# Altium schematic sheet ESenseFE-AnalogFilters.SchDoc
size C
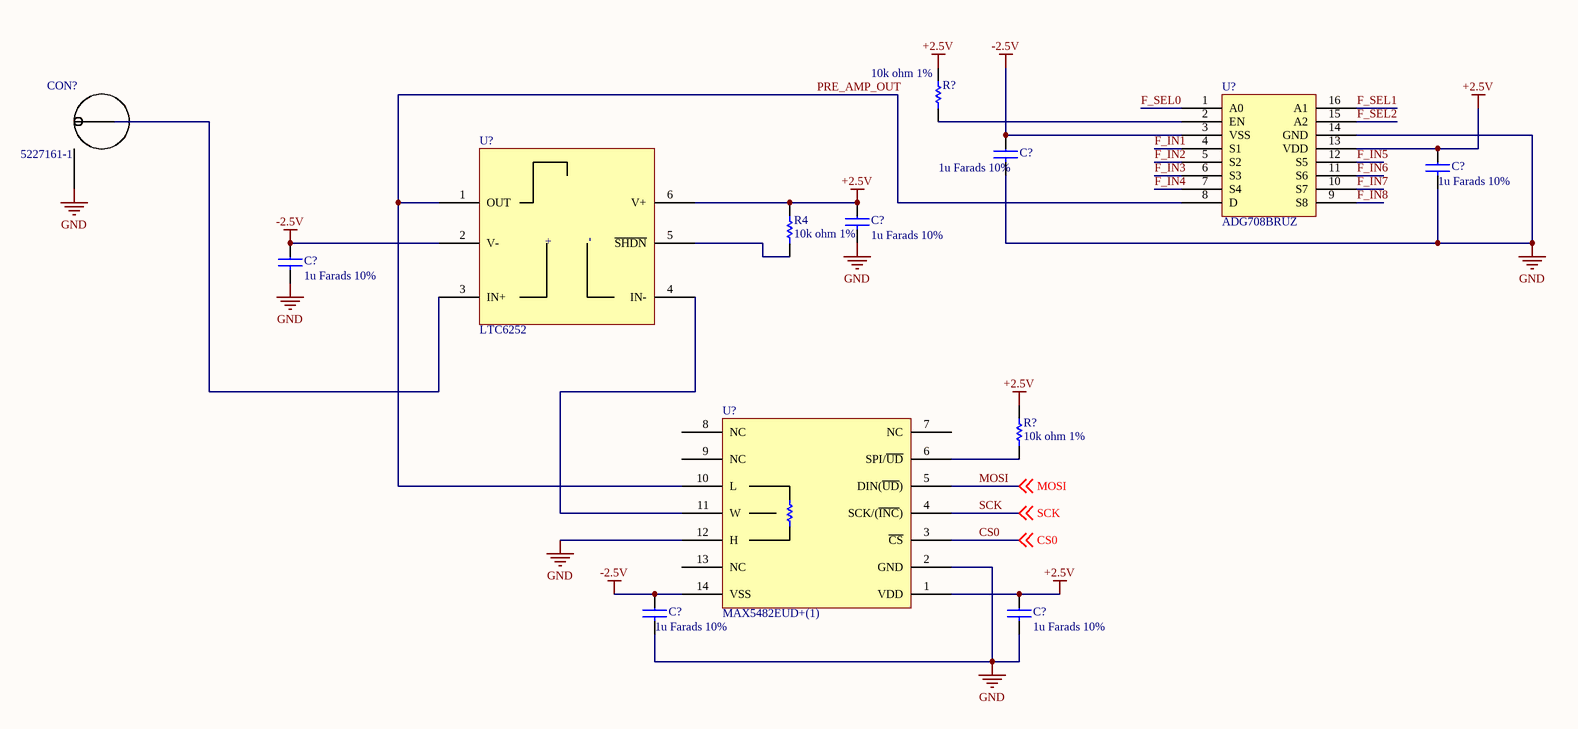
[diagram p0: ESenseFE-AnalogFilters.SchDoc]

## Parts
(Parts that share a designator on the sheet are numbered #1, #2 ... from top to bottom, then left to right.)
C?#1  1u Farads 10%  [SM/C_0603]
C?#2  1u Farads 10%  [SM/C_0603]
C?#3  1u Farads 10%  [SM/C_0603]
C?#4  1u Farads 10%  [SM/C_0603]
C?#5  1u Farads 10%  [SM/C_0603]
C?#6  1u Farads 10%  [SM/C_0603]
CON?  5227161-1  [BNC-RightAngle-PCB-50Ohm-Termination]
R4  10k ohm 1%  [SM/C_0603]
R?#1  10k ohm 1%  [SM/C_0603]
R?#2  10k ohm 1%  [SM/C_0603]
U?#1  ADG708BRUZ  [TSSOP-AD708-AnalogMux]
U?#2  LTC6252  [TSOT-23-LTC6252-OpAmp]
U?#3  MAX5482EUD+(1)  [TSSOP-16Lead-MAX548X]

## Nets
+2.5V: C?#2.1 C?#3.1 C?#6.1 R4.2 R?#1.2 R?#2.2 U?#1.13(VDD) U?#2.6(V+) U?#3.1(VDD)
-2.5V: C?#1.1 C?#4.1 C?#5.1 U?#1.3(VSS) U?#2.2(V-) U?#3.14(VSS)
GND: C?#1.2 C?#2.2 C?#3.2 C?#4.2 C?#5.2 C?#6.2 CON?.2 U?#1.14(GND) U?#3.2(GND) U?#3.12(H)
CS0: U?#3.3(~{CS}) ; off-sheet CS0
F_IN1: U?#1.4(S1)
F_IN2: U?#1.5(S2)
F_IN3: U?#1.6(S3)
F_IN4: U?#1.7(S4)
F_IN5: U?#1.12(S5)
F_IN6: U?#1.11(S6)
F_IN7: U?#1.10(S7)
F_IN8: U?#1.9(S8)
F_SEL0: U?#1.1(A0)
F_SEL1: U?#1.16(A1)
F_SEL2: U?#1.15(A2)
MOSI: U?#3.5(DIN(~{UD})) ; off-sheet MOSI
PRE_AMP_OUT: U?#1.8(D) U?#2.1(OUT) U?#3.10(L)
SCK: U?#3.4(SCK/(~{INC})) ; off-sheet SCK
NetCON?_1: CON?.1 U?#2.3(IN+)
NetR4_1: R4.1 U?#2.5(~{SHDN})
NetR?#1_1: R?#1.1 U?#1.2(EN)
NetR?#2_1: R?#2.1 U?#3.6(SPI/~{UD})
NetU?#2_4: U?#2.4(IN-) U?#3.11(W)

Not connected (* = marked no-connect by the designer): U?#3 7(NC) 8(NC) 9(NC) 13(NC)

## Notes on the sheet
- (in symbol 2192) +; -

## Library data of the parts
C?#1-C?#6 = 2065: CAP CER 1.0UF 10V 10% X5R 0603; mfrName: Murata Electronics North America; mfrPartNum: GRM188R61A105KA61D; Extra_Description: Datasheets	Chip Monolithic Ceramic Caps Part Numbering / GRM Series Spec/Test Methods (1) / GRM188R61A105KA61 / Product Photos	0603 Murata MLCC Caps / Product Training Modules	High-Cap Multilayer Ceramic Capacitors / Catalog Drawings	GRM Series Top, Sides / Standard Package	10 / Category	Capacitors / Family	Ceramic / Series	GRM / Capacitance	1.0µF / Voltage - Rated	10V / Tolerance	±10% / Temperature Coefficient	X5R / Mounting Type	Surface Mount, MLCC / Operating Temperature	-55°C ~ 85°C / Features	- / Applications	General Purpose / Ratings	- / Package / Case	0603 (1608 Metric) / Size / Dimension	0.063`` L x 0.032`` W (1.60mm x 0.80mm) / Lead Spacing	- / Thickness	0.80mm / Packaging	Cut Tape (CT) / Lead Style	- / Catalog Page	1886 (US2010 Interactive) / 1886 (US2010 PDF) / Other Names	490-1543-1; Obsolete: False; Temp_Max: 0; Type: Ceramic; PartID: 2065; URL_Image: HTTP://MEDIA.DIGIKEY.COM/PHOTOS/MURATA%20PHOTOS/0603%20MURATA%20MLCC%20CAPS.JPG; URL_Datasheet: http://search.murata.co.jp/Ceramy/image/img/w_hinm/L0005E.pdf; Date_Created: 9/27/2010 4:47:48 PM; Date_LastModified: 9/27/2010 4:47:48 PM; Verified: False; RoHS: True; Temp_Min: 0
CON? = 2189: jack bnc, right angle, pcb; connector type:bnc, coaxial;; mfrName: Tyco Electronics; Extra_Description: JACK BNC, RIGHT ANGLE, PCB; Connector Type:BNC, Coaxial; Impedance:50ohm; Contact Material:Phosphor Bronze; Contact Plating:Tin; Body Style:Right Angle; Termination Method:PC Board; Mounting Type:PC Board; External Depth:35.56mm; External Length / Height:13.18mm; Material:VALOX; Width, External:14.76mm; Dielectric Material:Polymethylpentene / Contact Plating: ``Tin`` / Termination Style: ``Solder Lug`` / Gender: ``Female`` / Packaging: ``Bulk`` / RoHS: ``Compliant`` / Mounting Type: ``PC Board`` / Lead-Free Status: ``Lead Free`` / Contact Material: ``Phosphor Bronze`` / Housing Material: ``Polyester`` / Color: ``White`` / Size-Height: { / ``uncertainty_minus``: null, / ``value``: 0.015875, / ``uncertainty_plus``: null / } / Frequency: { / ``max_value``: 4000000000.0, / ``max_uncertainty_plus``: null, / ``min_value``: null, / ``min_uncertainty_plus``: null, / ``max_uncertainty_minus``: null / }; Obsolete: False; Temp_Max: 0; TypeNotes: Applies to all parts in the database; PartID: 2189; mfrPartNum: 5227161-1; URL_Image: http://cdn.sigma.octopart.com/9201634/image/Tyco-Electronics-5227161-1.jpg; URL_Datasheet: http://datasheet.octopart.com/5227161-1-Tyco-Electronics-datasheet-548244.pdf; Date_Created: 5/5/2011 8:50:02 AM; Date_LastModified: 5/5/2011 8:50:02 AM; Verified: False; RoHS: True; Temp_Min: 0; Type: All Parts
R4 R?#1 R?#2 = 2165: resistor, 0603, 0.1w, 1%, 10k; resistance:10kohm; resistance; mfrName: Panasonic; mfrPartNum: ERJ-3EKF1002V; Value: 1K; Extra_Description: RESISTOR, 0603, 0.1W, 1%, 10K; Resistance:10kohm; Resistance Tolerance:± 1%; Power Rating:0.1W; Voltage Rating:75V; Series:ERJ; Temperature Coefficient:± 200ppm/°C; Resistor Element Type:Thick Film; Resistor Case Style:0603; No. of Pins:2; Case Style:0603; External Length / Height:0.45mm; External Depth:0.8mm; External Width:1.6mm; Operating Temperature Range:-55°C to +155°C; Overload Voltage:150V; Reel Quantity:5000; Termination Type:SMD / Mounting Type: ``Surface Mount`` / Case / Package: ``0603`` / Packaging: ``Cut Tape (CT)`` / Lead-Free Status: ``Contains Lead`` / RoHS: ``Compliant`` / Resistance: { / ``uncertainty_minus``: null, / ``value``: 10000.0, / ``uncertainty_plus``: null / } / Voltage Rating (DC): { / ``uncertainty_minus``: null, / ``value``: 75.0, / ``uncertainty_plus``: null / } / Size-Width: { / ``uncertainty_minus``: null, / ``value``: 0.0008, / ``uncertainty_plus``: null / } / Size-Length: { / ``uncertainty_minus``: null, / ``value``: 0.0016, / ``uncertainty_plus``: null / } / Size-Height: { / ``uncertainty_minus``: null, / ``value``: 0.00045, / ``uncertainty_plus``: null / } / Power Rating: { / ``uncertainty_minus``: null, / ``value``: 0.1, / ``uncertainty_plus``: null / } / Resistance Tolerance: { / ``max_value``: 1.0, / ``max_uncertainty_plus``: null, / ``min_value``: -1.0, / ``min_uncertainty_plus``: null, / ``max_uncertainty_minus``: null / } / Operating Temperature: { / ``max_value``: 125.0, / ``max_uncertainty_plus``: null, / ``min_value``: null, / ``min_uncertainty_plus``: null, / ``max_uncertainty_minus``: null / } / Number of Pins: 2; Obsolete: False; Temp_Max: 0; TypeNotes: Applies to all parts in the database; Published: 8-Jun-2000; LatestRevisionDate: 17-Jul-2002; LatestRevisionNote: Re-released for DXP Platform.; PackageReference: AXIAL-0.3; Publisher: Altium Limited; PartID: 2165; URL_Image: http://cdn.sigma.octopart.com/8893006/image/Panasonic-ERJ-3EKF1002V.jpg; URL_Datasheet: http://datasheet.octopart.com/ERJ-3EKF1002V-Panasonic-datasheet-118621.pdf; Date_Created: 4/24/2011 7:23:38 AM; Date_LastModified: 4/24/2011 7:23:38 AM; Verified: False; RoHS: True; Temp_Min: 0; Type: All Parts
U?#1 = 2190: mux 8ch low volt, smd, tssop16, 708; switch type,; mfrName: Analog Devices; Extra_Description: MUX 8CH LOW VOLT, SMD, TSSOP16, 708; Switch Type, Analogue:Low Voltage; Switches, No. of:8; Voltage, Supply Source:Single; Interface Type:Parallel; Resistance, On State:3ohm; Voltage, Supply Min:1.8V; Voltage, Supply Max:5.5V; Termination Type:SMD; Case Style:TSSOP; No. of Pins:16; Operating Temperature Range:-40°C to +85°C; Base Number:708; IC Generic Number:708; No. of Channels:8; Packaging Type:Peel Pack; Resistance, Rds On:5ohm; Temp, Op. Max:85°C; Temp, Op. Min:-40°C; Analogue Multiplexer Type:8 Channel Single Pole / Mounting Type: ``Surface Mount`` / Case / Package: ``TSSOP-16`` / Packaging: ``Bulk`` / Lead-Free Status: ``Lead Free`` / RoHS: ``Compliant`` / Supply Voltage (DC): { / ``max_value``: 5.5, / ``max_uncertainty_plus``: null, / ``min_value``: null, / ``min_uncertainty_plus``: null, / ``max_uncertainty_minus``: null / } / Number of Channels: 8 / Number of Circuits: 1 / Number of Pins: 16; Obsolete: False; Temp_Max: 0; TypeNotes: Applies to all parts in the database; PartID: 2190; mfrPartNum: ADG708BRUZ; URL_Image: http://cdn.sigma.octopart.com/175041/image/Analog-Devices-ADG708BRUZ.jpg; URL_Datasheet: http://datasheet.octopart.com/ADG708BRUZ-Analog-Devices-datasheet-6854.pdf; Date_Created: 5/5/2011 9:39:24 AM; Date_LastModified: 5/5/2011 9:39:24 AM; Verified: False; RoHS: True; Temp_Min: 0; Type: All Parts
U?#2 = 2192: op amp, r/r 200mhz single, soic8; no. of amplifiers:1; op amp; mfrName: Linear Technology; Extra_Description: Family	Linear - Amplifiers - Instrumentation, OP Amps, Buffer Amps / Series	- / Amplifier Type	General Purpose / Number of Circuits	1 / Output Type	Rail-to-Rail / Slew Rate	280 V/µs / Gain Bandwidth Product	720MHz / -3db Bandwidth	400MHz / Current - Input Bias	1.4µA / Voltage - Input Offset	100µV / Current - Supply	4.25mA / Current - Output / Channel	100mA / Voltage - Supply, Single/Dual (±)	2.5 V ~ 5.25 V, ±1.25 V ~ 2.625 V / Operating Temperature	-40°C ~ 125°C / Mounting Type	Surface Mount / Package / Case	SOT-23-6 Thin, TSOT-23-6 / Supplier Device Package	TSOT-23-6 / Packaging	Digi-Reel® / Other Names	LTC6252HS6#TRMPBFDKR / Alternate Package / This part is also available in the following packaging:; Obsolete: False; Temp_Max: 0; TypeNotes: Applies to all parts in the database; PartID: 2192; mfrPartNum: LTC6252; URL_Image: http://cds.linear.com/images/product/4358_pack_1.jpg; URL_Datasheet: http://datasheet.octopart.com/LTC6240CS8%23PBF-Linear-Technology-datasheet-502703.pdf; Date_Created: 5/5/2011 10:07:10 AM; Date_LastModified: 5/5/2011 10:07:10 AM; Verified: False; RoHS: True; Temp_Min: 0; Type: All Parts
U?#3 = 2194: dpot, nv, linear taper, 10 bit, smd; resistance range; mfrName: MAXIM; Extra_Description: DPOT, NV, LINEAR TAPER, 10 BIT, SMD; Resistance Range Type:Linear; Memory Type:Non-Volatile; No. of Channels:1; No. of Positions:1024; Resistance, End-to-End:10kohm; Interface Type:SPI, Serial, 3 Wire; Voltage, Supply Min:2.7V; Voltage, Supply Max:5.25V; Termination Type:SMD; Case Style:TSSOP; No. of Pins:14; Operating Temperature Range:-40°C to +85°C; Temp, Op. Max:85°C; Temp, Op. Min:-40°C; Base Number:5483; Supply Voltage:2.7V; Track Resistance:10kohm / RoHS: ``Compliant`` / Supply Voltage (DC): { / ``uncertainty_minus``: null, / ``value``: 2.7, / ``uncertainty_plus``: null / } / Resistance Tolerance: { / ``max_value``: 25.0, / ``max_uncertainty_plus``: null, / ``min_value``: -25.0, / ``min_uncertainty_plus``: null, / ``max_uncertainty_minus``: null / } / Number of Pins: 14; Obsolete: False; Temp_Max: 0; TypeNotes: Applies to all parts in the database; PartID: 2194; mfrPartNum: MAX5482EUD+(1); URL_Image: http://cdn.sigma.octopart.com/8907955/image/Maxim-MAX5483EUD%2B.jpg; URL_Datasheet: http://datasheet.octopart.com/MAX5483EUD%2B-Maxim-datasheet-529274.pdf; Date_Created: 5/5/2011 10:56:31 AM; Date_LastModified: 5/5/2011 10:56:31 AM; Verified: False; RoHS: True; Temp_Min: 0; Type: All Parts